# EAGLE design IR_repeater (EAGLE 9.6.2)
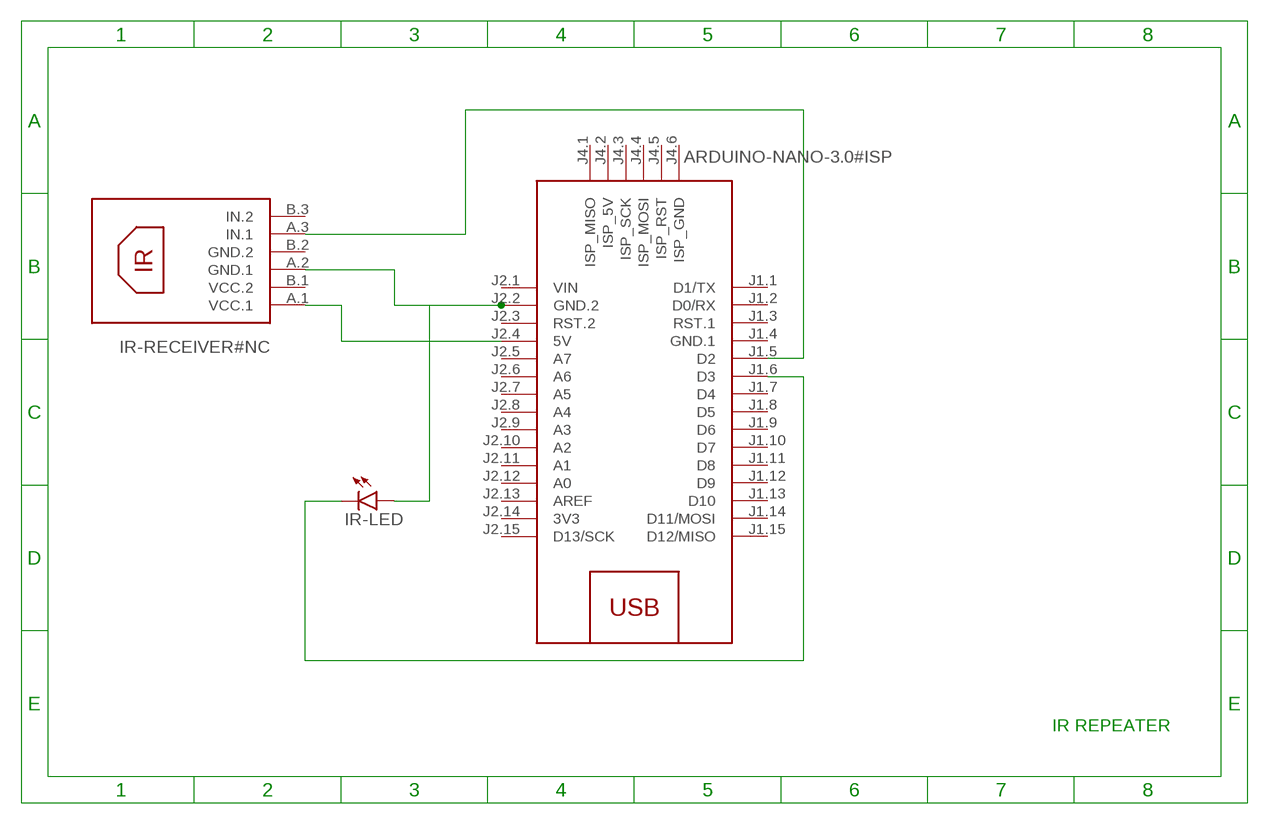
[diagram p0: schematic, sheet 1]

## Parts
IR-LED  SFH482  [SFH482]
IR-RECEIVER  IR-RECEIVER#NC  [IR-RECEIVER#NC]
M1  ARDUINO-NANO-3.0#ISP  [ARDUINO-NANO-3.0#ISP]

## Nets
N$1: IR-RECEIVER.A.1(VCC.1) M1.J2.4(5V)
N$3: IR-RECEIVER.A.3(IN.1) M1.J1.5(D2)
N$4: IR-LED.K(C) M1.J1.6(D3)
N$5: IR-LED.A IR-RECEIVER.A.2(GND.1) M1.J2.2(GND.2)
Unconnected: IR-RECEIVER.B.1(VCC.2) IR-RECEIVER.B.2(GND.2) IR-RECEIVER.B.3(IN.2) M1.J1.1(D1/TX) M1.J1.2(D0/RX) M1.J1.3(RST.1) M1.J1.7(D4) M1.J1.8(D5) M1.J1.9(D6) M1.J1.10(D7) M1.J1.11(D8) M1.J1.12(D9) M1.J1.13(D10) M1.J1.14(D11/MOSI) M1.J1.15(D12/MISO) M1.J2.3(RST.2) M1.J2.5(A7) M1.J2.6(A6) M1.J2.7(A5) M1.J2.8(A4) M1.J2.9(A3) M1.J2.10(A2) M1.J2.11(A1) M1.J2.12(A0) M1.J2.13(AREF) M1.J2.15(D13/SCK) M1.J4.1(ISP_MISO) M1.J4.2(ISP_5V) M1.J4.3(ISP_SCK) M1.J4.4(ISP_MOSI) M1.J4.5(ISP_RST) M1.J4.6(ISP_GND)

## Notes on the sheet
- IR REPEATER

## Power pins joined to a net without a drawn wire
3V3: M1.J2.14(3V3)
GND.1: M1.J1.4(GND.1)
VIN: M1.J2.1(VIN)

## Library data of the parts
IR-LED = led:SFH482: IR LED infrared emitting diode, Infineon
IR-RECEIVER = all_DIY:IR-RECEIVER#NC: IR Receiver Module without IR sensor connector
M1 = all_DIY:ARDUINO-NANO-3.0#ISP: Arduino Nano 3.0 (and compatible devices) with ISP pads More details available here: https://www.arduino.cc/en/Main/ArduinoBoardNano Click here to find device on ebay.com <http://www.ebay.com/sch/arduino+nano>

## Board
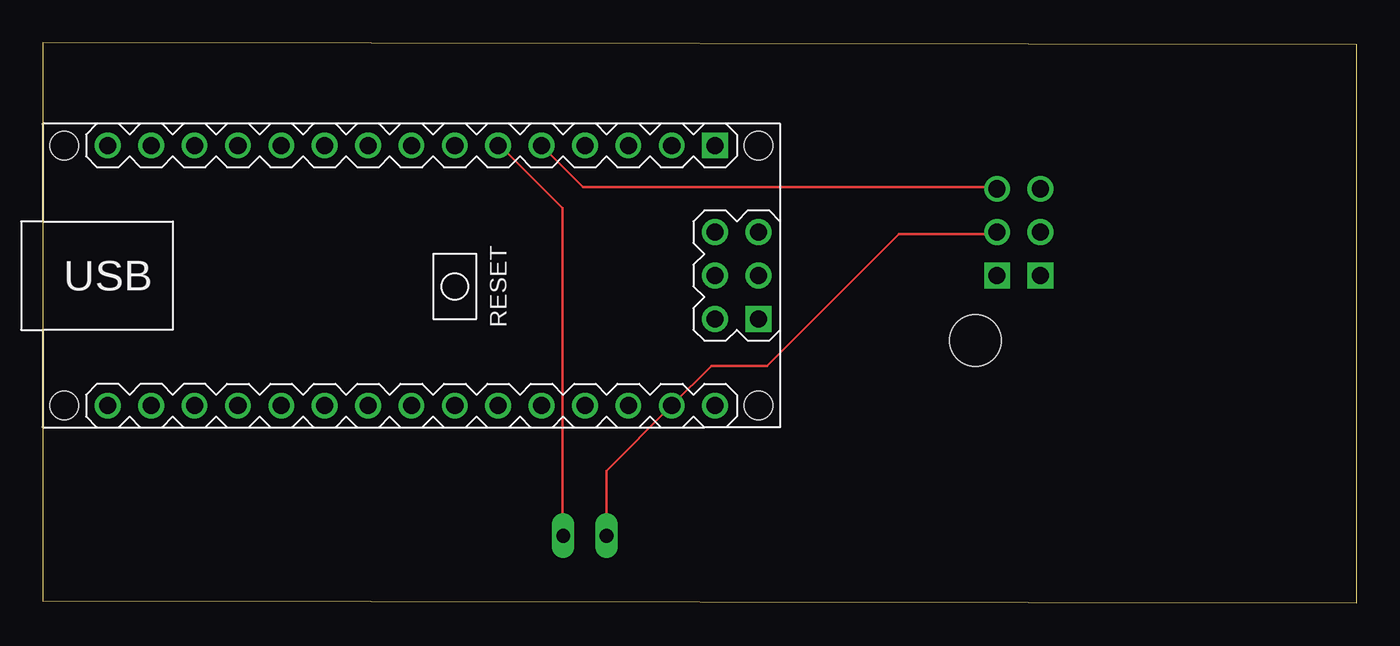
[diagram p1: board, top side]
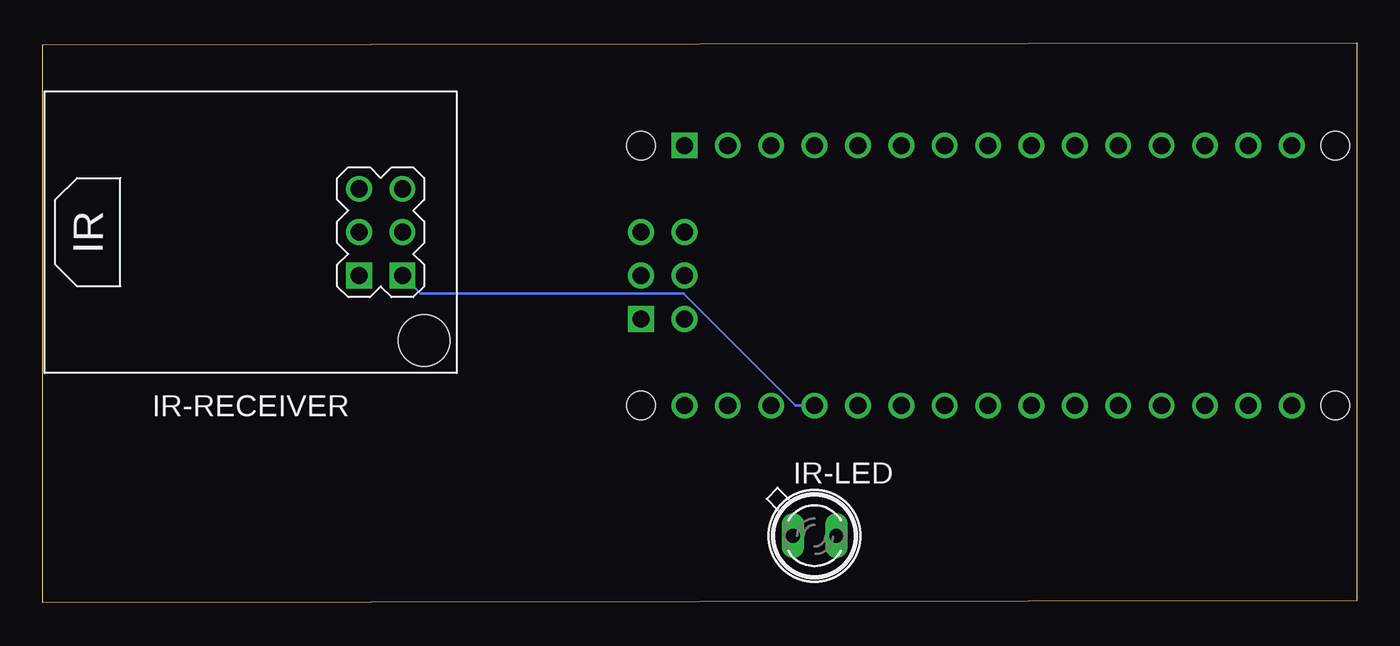
[diagram p2: board, bottom side, seen from below]

Size 76.94 x 32.82 mm. Coordinates in mm from the lower left corner, seen from the top.
Outline: 0,0.13 76.94,0 76.94,32.69 0,32.82 0,0.13
Copper layers (1*16): Top 0.035mm / dielectric 1.5mm / Bottom 0.035mm
Design rules "default": minimum track width 6mil, minimum drill 0.35mm, track to track 6mil, track to pad 6mil, pad to pad 6mil, via to via 6mil, smd to smd 6mil, copper to edge 40mil, drill to drill 6mil, minimum pad ring 10mil, minimum via ring 8mil, stop-mask expansion 4mil, vias tented up to drill 0mil, thermal gap 10mil

### Footprints (pad centres in the part's own frame; a part is rotated, then mirrored left to right if it is on the bottom)
SFH482 = drill 0.813 long: A -1.27,0; K 1.27,0
IR-RECEIVER#NC = drill 1 square: A.1 -8.89,2.54; B.1 -6.35,2.54 | drill 1: A.2 -8.89,0; A.3 -8.89,-2.54; B.2 -6.35,0; B.3 -6.35,-2.54 | hole 3: -10.16,6.35
ARDUINO-NANO-3.0#ISP = drill 1 square: J1.1 17.78,7.62; J4.1 20.32,-2.54 | drill 1: J1.2 15.24,7.62; J1.3 12.7,7.62; J1.4 10.16,7.62; J1.5 7.62,7.62; J1.6 5.08,7.62; J1.7 2.54,7.62; J1.8 0,7.62; J1.9 -2.54,7.62; J1.10 -5.08,7.62; J1.11 -7.62,7.62; J1.12 -10.16,7.62; J1.13 -12.7,7.62; J1.14 -15.24,7.62; J1.15 -17.78,7.62; J2.1 17.78,-7.62; J2.2 15.24,-7.62; J2.3 12.7,-7.62; J2.4 10.16,-7.62; J2.5 7.62,-7.62; J2.6 5.08,-7.62; J2.7 2.54,-7.62; J2.8 0,-7.62; J2.9 -2.54,-7.62; J2.10 -5.08,-7.62; J2.11 -7.62,-7.62; J2.12 -10.16,-7.62; J2.13 -12.7,-7.62; J2.14 -15.24,-7.62; J2.15 -17.78,-7.62; J4.2 17.78,-2.54; J4.3 20.32,0; J4.4 17.78,0; J4.5 20.32,2.54; J4.6 17.78,2.54 | hole 1.651: -20.32,7.62; -20.32,-7.62; 20.32,-7.62; 20.32,7.62

### Placement (x,y rotation side)
IR-LED  31.75,3.94 0 bottom
IR-RECEIVER  64.77,21.72 180 bottom
M1  21.59,19.18 0 top

### Tracks (layer width: path | path; a pad name or v marks a point on that pad's centre or on a via)
N$1
  Bottom 0.152: M1.J2.4 32.87,11.56 39.42,18.11 54.81,18.11 IR-RECEIVER.A.1
N$3
  Top 0.152: M1.J1.5 31.65,24.36 55.88,24.36 IR-RECEIVER.A.3
N$4
  Top 0.152: IR-LED.K 30.43,3.99 30.43,23.14 26.77,26.8 M1.J1.6
N$5
  Top 0.152: IR-LED.A 33.02,7.75 M1.J2.2 39.17,13.89 42.42,13.89 50.14,21.61 55.88,21.61 IR-RECEIVER.A.2